# EAGLE design SignalMast-ColorLight-DualHead (EAGLE 7.7.0)
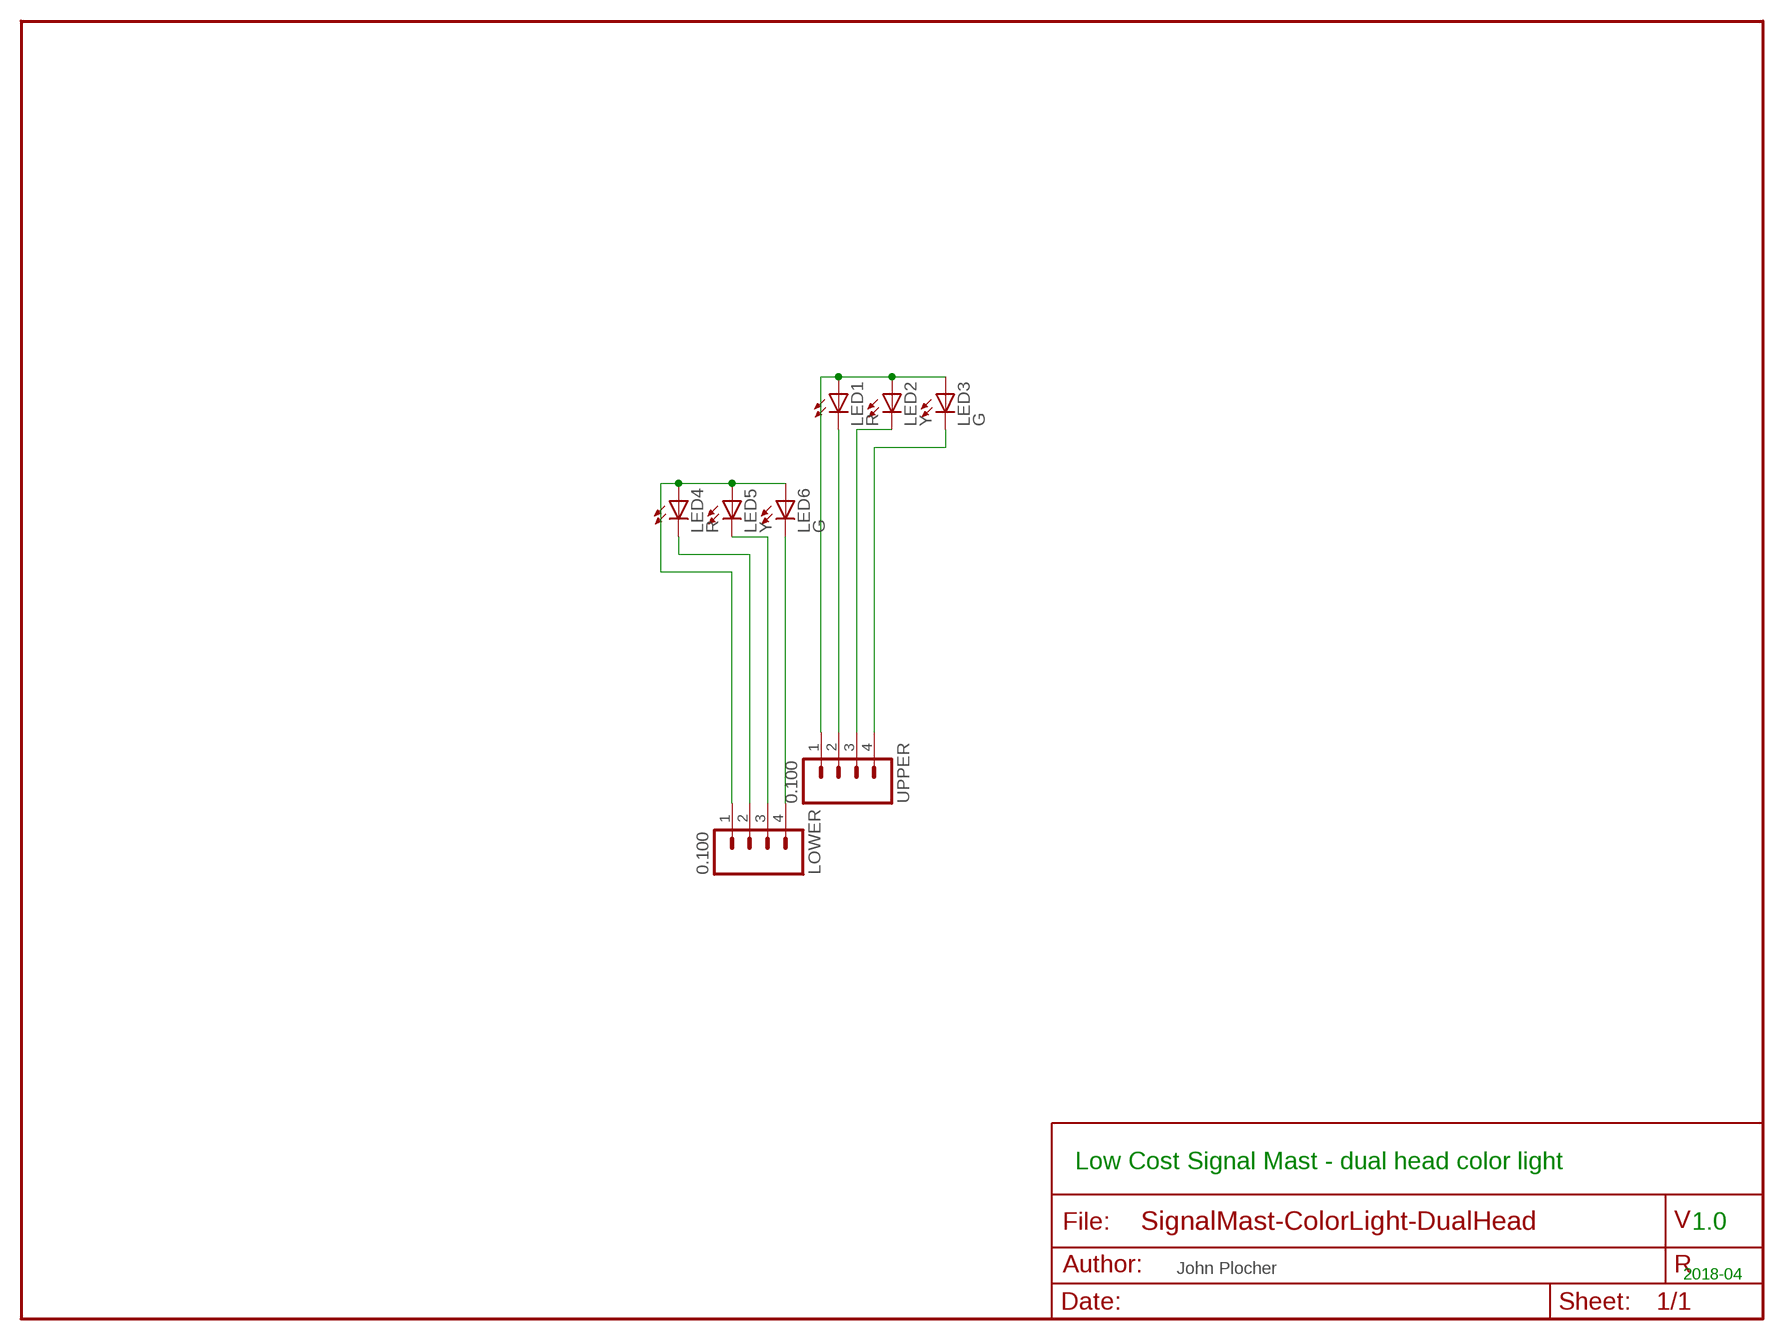
[diagram p0: schematic, sheet 1]

## Parts
LED1  R  LED0603-LED  [0603-LED]
LED2  Y  LED0603-LED  [0603-LED]
LED3  G  LED0603-LED  [0603-LED]
LED4  R  LED0603-LED  [0603-LED]
LED5  Y  LED0603-LED  [0603-LED]
LED6  G  LED0603-LED  [0603-LED]
LOWER  0.100  CONNECTOR-M04LOCK  [1X04_LOCK]
UPPER  0.100  CONNECTOR-M04LOCK  [1X04_LOCK]

## Nets
AG: LED6.C LOWER.4
AR: LED4.C LOWER.2
AV+: LED4.A LED5.A LED6.A LOWER.1
AY: LED5.C LOWER.3
BG: LED3.C UPPER.4
BR: LED1.C UPPER.2
BV+: LED1.A LED2.A LED3.A UPPER.1
BY: LED2.C UPPER.3

## Notes on the sheet
- Low Cost Signal Mast - dual head color light
- 1.0
- John Plocher
- 2018-04

## Library data of the parts
LED1 LED4 = SPCoast:LED*; OPL: 19-217-R6C-AL1M2VY-3T
LED2 LED5 = SPCoast:LED*; OPL: 19-217-Y5C-AM1N1VY-3T
LED3 LED6 = SPCoast:LED*; OPL: 19-217-G7C-AN1P2-3T
LOWER UPPER = SPCoast:CONNECTOR-M04: Header 4 Standard 4-pin 0.1" header. Use with straight break away headers (SKU : PRT-00116), right angle break away headers (PRT-00553), swiss pins (PRT-00743), machine pins (PRT-00117), and female headers (PRT-00115). Molex polarized connector foot print use with SKU : PRT-08231 with associated crimp pins and housings. 1MM SMD Version SKU: PRT-10208

## Net classes
0 default: width 0.203 mm

## Board
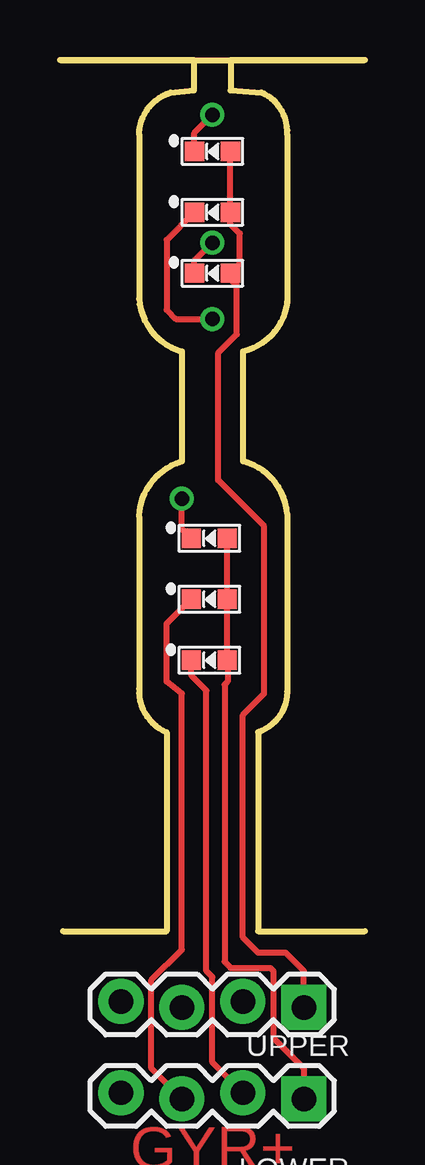
[diagram p1: board, top side]
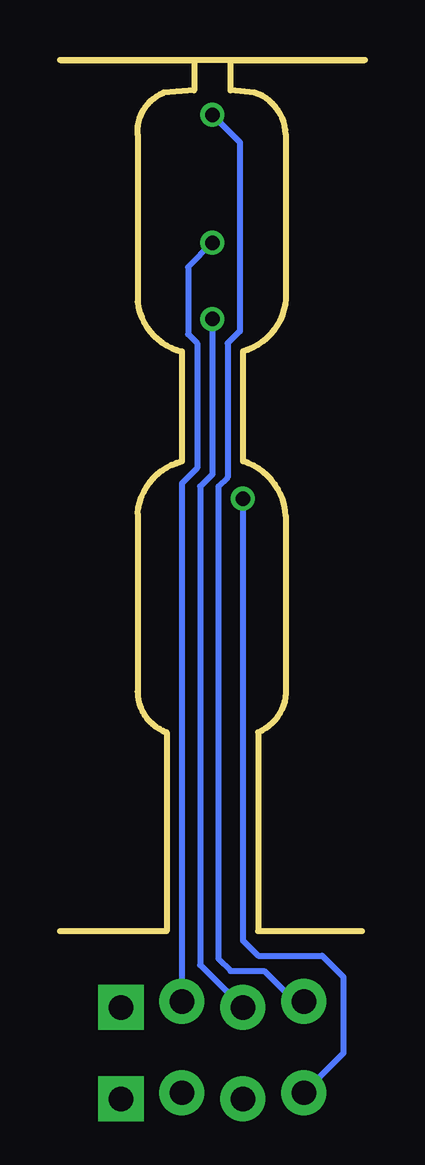
[diagram p2: board, bottom side, seen from below]

Size 12.7 x 36.32 mm. Coordinates in mm from the lower left corner, seen from the top.
Outline: 0.13,0 4.45,0 4.45,8.3 arc-70 3.29,10.11 3.29,17.3 arc-70 5.08,19.6 5.08,24.17 arc-70 3.29,26.36 3.29,33.22 arc-70 4.6,34.97 5.59,35.05 5.59,36.32 0,36.32
Outline: 12.7,0 8.26,0 8.26,8.3 arc70 9.47,9.98 9.47,17.42 arc70 7.62,19.6 7.62,24.17 arc70 9.47,26.24 9.47,33.22 arc70 8.38,34.97 7.11,35.05 7.11,36.32 12.7,36.32
Copper layers (1*16): Top 0.035mm / dielectric 1.5mm / Bottom 0.035mm
Design rules "default": minimum track width 10mil, minimum drill 24mil, track to track 8mil, track to pad 8mil, pad to pad 8mil, via to via 8mil, smd to smd 8mil, copper to edge 40mil, drill to drill 8mil, minimum pad ring 10mil, minimum via ring 8mil, stop-mask expansion 4mil, vias tented up to drill 0mil, thermal gap 10mil
Milling: 1 lines

### Footprints (pad centres in the part's own frame; a part is rotated, then mirrored left to right if it is on the bottom)
0603-LED = smd 0.8 x 0.8: A 0.75,0; C -0.75,0
1X04_LOCK = drill 1.016 pad 1.88 square: 1 0,0.127 | drill 1.016 pad 1.88: 2 2.54,-0.127; 3 5.08,0.127; 4 7.62,-0.127

### Placement (x,y rotation side)
LED1  6.35,27.43 0 top
LED2  6.35,29.97 0 top
LED3  6.35,32.51 0 top
LED4  6.22,11.3 0 top
LED5  6.22,13.84 0 top
LED6  6.22,16.38 0 top
LOWER  10.16,-6.86 180 top  (outside the outline)
UPPER  10.16,-3.05 180 top

### Tracks (layer width: path | path; a pad name or v marks a point on that pad's centre or on a via)
AG  (via drill 0.6)
  Top 0.254: LED6.C 5.08,16.78 v5.08,18.03
  Bottom 0.254: v5.08,18.03 5.08,-0.38 4.45,-1.02 1.78,-1.02 0.89,-1.9 0.89,-5.08 LOWER.4
AR
  Top 0.254: LOWER.2 6.35,-5.46 6.35,-1.9 6.1,-1.65 6.1,10.03 5.47,10.66 LED4.C
AV+
  Top 0.254: LED6.A LED5.A LED4.A 6.99,11.29 6.99,10.41 6.86,10.29 6.86,-1.27 7.11,-1.52 8.76,-1.52 8.89,-1.65 8.89,-4.44 10.16,-5.71 LOWER.1
AY
  Top 0.254: LOWER.3 3.81,-5.71 3.81,-2.03 5.08,-0.76 5.08,9.91 4.45,10.41 4.45,12.83 LED5.C
BG  (via drill 0.6)
  Top 0.254: LED3.C 5.6,33.29 v6.35,34.04
  Bottom 0.254: v6.35,34.04 5.21,32.89 5.21,25.02 5.71,24.51 5.71,18.92 6.1,18.54 6.1,-1.14 5.59,-1.65 4.19,-1.65 2.92,-2.92 UPPER.4
BR  (via drill 0.6)
  Top 0.254: LED1.C 5.59,27.95 v6.35,28.7
  Bottom 0.254: v6.35,28.7 7.37,27.69 7.37,24.89 6.99,24.51 6.99,19.3 7.62,18.67 UPPER.2
BV+
  Top 0.254: UPPER.1 10.16,-1.65 9.4,-0.89 8.26,-0.89 7.62,-0.25 7.62,9.02 8.51,9.91 8.51,16.89 6.59,18.81 6.6,24.13 7.37,24.89 7.37,26.92 7.1,27.19 LED1.A 7.49,27.83 7.49,29.08 7.1,29.48 LED2.A LED3.A
BY  (via drill 0.6)
  Top 0.254: LED2.C 4.45,28.82 4.45,25.91 4.83,25.53 v6.35,25.53
  Bottom 0.254: v6.35,25.53 6.35,19.05 6.86,18.54 6.86,-1.4 UPPER.3

### Text on the board
Top: GYR+